# Altium schematic sheet Sheet_1_2025-02-26.schdoc
size 300 x 182 mm
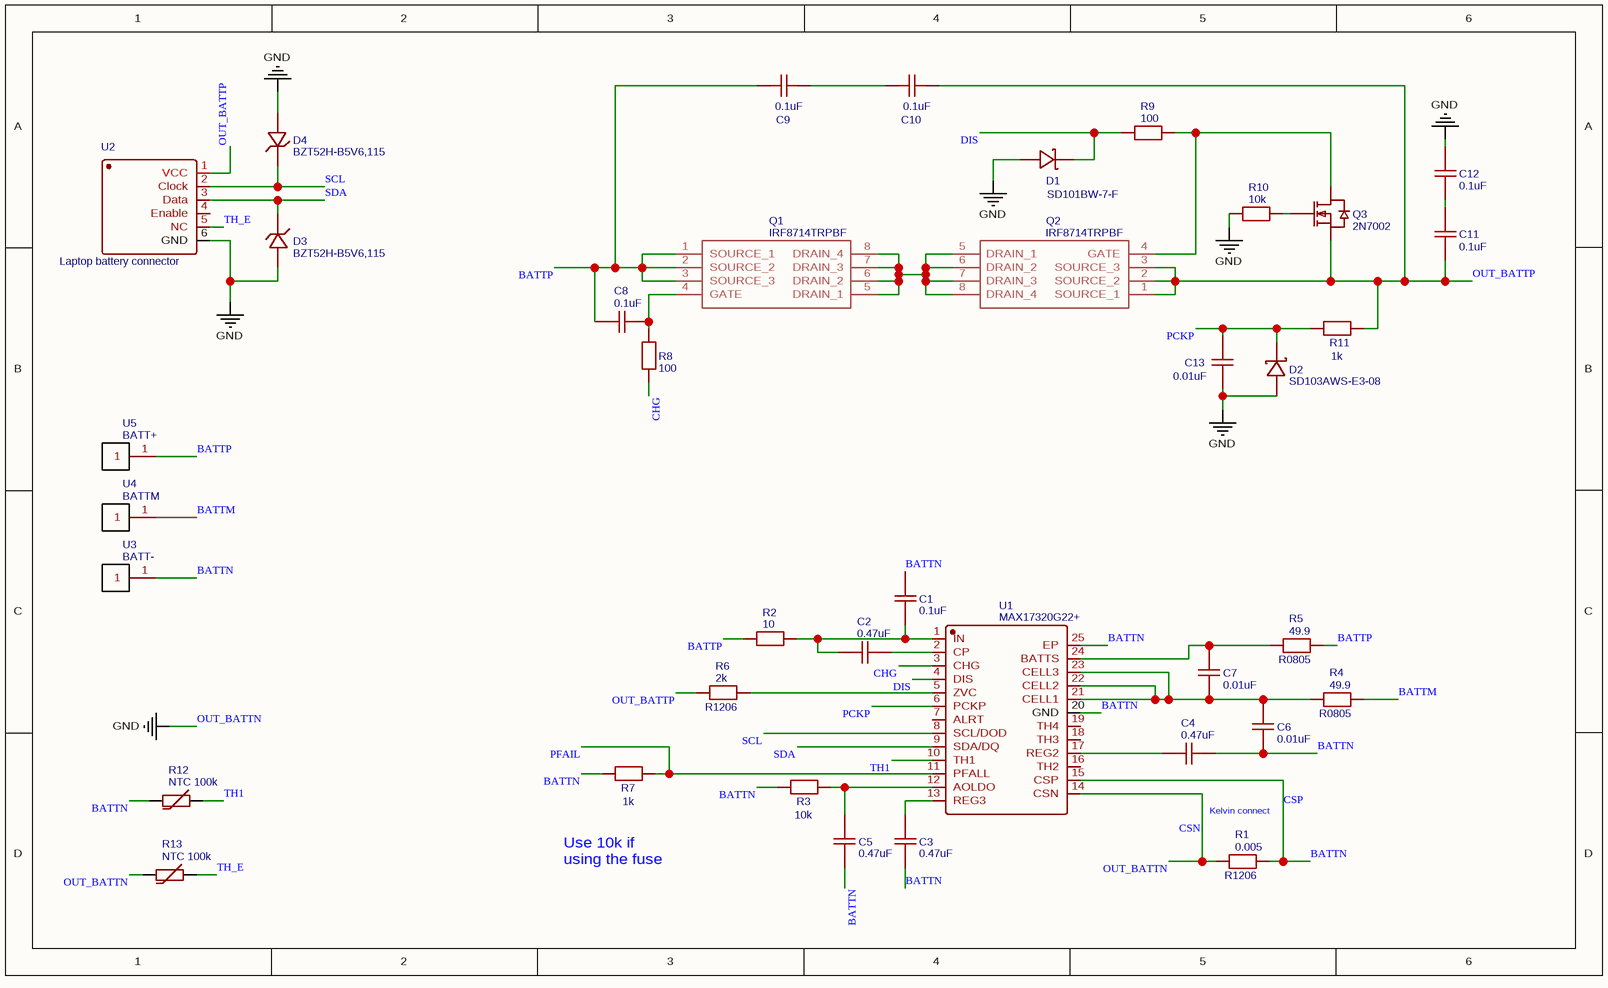
[diagram p0: Sheet_1_2025-02-26.schdoc]

## Parts
C1  0.1uF  [C0402]
C2  0.47uF  [C0402]
C3  0.47uF  [C0402]
C4  0.47uF  [C0402]
C5  0.47uF  [C0402]
C6  0.01uF  [C0402]
C7  0.01uF  [C0402]
C8  0.1uF  [C0402]
C9  0.1uF  [C0402]
C10  0.1uF  [C0402]
C11  0.1uF  [C0402]
C12  0.1uF  [C0402]
C13  0.01uF  [C0402]
D1  SD101BW-7-F  [SOD-323_L1.8-W1.3-LS2.5-RD]
D2  SD103AWS-E3-08  [SOD-323_L1.8-W1.3-LS2.5-RD]
D3  BZT52H-B5V6,115  [SOD-123F_L2.8-W1.8-LS3.7-RD]
D4  BZT52H-B5V6,115  [SOD-123F_L2.8-W1.8-LS3.7-RD]
Q1  IRF8714TRPBF  [SOIC127P600X175-8N]
Q2  IRF8714TRPBF  [SOIC127P600X175-8N]
Q3  2N7002  [SOT-23-3_L2.9-W1.3-P1.90-LS2.4-BR]
R1  0.005  [R1206]
R2  10  [R0402]
R3  10k  [R0402]
R4  49.9  [R0805]
R5  49.9  [R0805]
R6  2k  [R1206]
R7  1k  [R0402]
R8  100  [R0402]
R9  100  [R0402]
R10  10k  [R0402]
R11  1k  [R0402]
R12  NTC 100k  [R0805]
R13  NTC 100k  [R0805]
U1  MAX17320G22+  [QFN-24_L4.0-W4.0-P0.50-BL-EP2.6]
U2  Laptop battery connector  [6 PIN LAPTOP CONNECTOR]
U3  BATT-  [PAD-1X-5X5MM]
U4  BATTM  [PAD-1X-5X5MM]
U5  BATT+  [PAD-1X-5X5MM]

## Nets
CSN: C12.2 C13.2 D1.2(A) D2.2(A) D3.2(A) D4.2(A) R1.1 R10.1 R13.1 U1.14(CSN) U2.6(GND)  [also labelled GND, OUT_BATTN]
BATTM: R4.2 U4.1
BATTN: C1.2 C3.1 C4.1 C5.2 C6.1 R1.2 R3.1 R7.1 R12.1 U1.15(CSP) U1.20(GND) U1.25(EP) U3.1  [also labelled CSP]
BATTP: C8.2 C9.2 Q1.1(SOURCE_1) Q1.2(SOURCE_2) Q1.3(SOURCE_3) R2.1 R5.2 U5.1
CHG: R8.1 U1.3(CHG)
DIS: D1.1(C) R9.1 U1.4(DIS)
OUT_BATTP: C10.1 C11.1 Q2.1(SOURCE_1) Q2.2(SOURCE_2) Q2.3(SOURCE_3) Q3.2(S) R6.1 R11.2 U2.1(VCC)
PCKP: C13.1 D2.1(K) R11.1 U1.6(PCKP)
PFAIL: R7.2 U1.11(PFALL)
SCL: D4.1(C) U1.8(SCL/DOD) U2.2(Clock)
SDA: D3.1(C) U1.9(SDA/DQ) U2.3(Data)
TH1: R12.2 U1.10(TH1)
TH_E: R13.2 U2.5(NC)
NetC1_1: C1.1 C2.2 R2.2 U1.1(IN)
NetC2_1: C2.1 U1.2(CP)
NetC3_2: C3.2 U1.13(REG3)
NetC4_2: C4.2 U1.17(REG2)
NetC5_1: C5.1 R3.2 U1.12(AOLDO)
NetC6_2: C6.2 C7.2 R4.1 U1.21(CELL1) U1.22(CELL2) U1.23(CELL3)
NetC7_1: C7.1 R5.1 U1.24(BATTS)
NetC8_1: C8.1 Q1.4(GATE) R8.2
NetC9_1: C9.1 C10.2
NetC11_2: C11.2 C12.1
NetQ1_5: Q1.5(DRAIN_1) Q1.6(DRAIN_2) Q1.7(DRAIN_3) Q1.8(DRAIN_4) Q2.5(DRAIN_1) Q2.6(DRAIN_2) Q2.7(DRAIN_3) Q2.8(DRAIN_4)
NetQ2_4: Q2.4(GATE) Q3.3(D) R9.2
NetQ3_1: Q3.1(G) R10.2
NetR6_2: R6.2 U1.5(ZVC)

Not connected (* = marked no-connect by the designer): U1 7(ALRT) 16(TH2) 18(TH3) 19(TH4); U2 4(Enable)

## Notes on the sheet
- Use 10k if
  using the fuse
- Kelvin connect
- (in symbol 0.005) R1206
- (in symbol 2k) R1206
- (in symbol 49.9) R0805

## Library data of the parts
C1 C8-C12 = 0.1uF: nameAlias: Value(F); Contributor: LCEDA_Lib; Note: 25V; spicePre: C; spiceSymbolName: C_0603_US
C2 = 0.47uF: nameAlias: Value(F); Contributor: LCEDA_Lib; Package Display: No; Note: 25V; spicePre: C; spiceSymbolName: C_0603_US
C3-C5 = 0.47uF: nameAlias: Value(F); Contributor: LCEDA_Lib; Note: 10V; spicePre: C; spiceSymbolName: C_0603_US
C6 C7 = 0.01uF: nameAlias: Value(F); Contributor: LCEDA_Lib; Note: 10V; spicePre: C; spiceSymbolName: C_0603_US
C13 = 0.01uF: nameAlias: Value(F); Contributor: LCEDA_Lib; Note: 50V; spicePre: C; spiceSymbolName: C_0603_US
D1 = SD101BW-7-F: Manufacturer: Diodes Incorporated; Manufacturer Part: SD101BWS-7-F; Contributor: LCSC; Supplier: LCSC; Supplier Part: C526757; JLCPCB Part Class: Extended Part; spicePre: D; spiceSymbolName: SD101BWS-7-F
D2 = SD103AWS-E3-08: Manufacturer: VISHAY; Contributor: LCSC; Supplier: LCSC; Manufacturer Part: SD103AWS-E3-08; Supplier Part: C142592; JLCPCB Part Class: Extended Part; spicePre: D; spiceSymbolName: SD103AWS-E3-08
D3 D4 = BZT52H-B5V6,115: Manufacturer: Nexperia; Contributor: LCSC; Supplier: LCSC; Supplier Part: C426804; Manufacturer Part: BZT52H-B5V6,115; JLCPCB Part Class: Extended Part; spicePre: D; spiceSymbolName: BZT52H-B5V6,115
Q1 Q2 = IRF8714TRPBF: Contributor: Jorge Ignacio Sánchez Flores; spicePre: Q; spiceSymbolName: IRF8714TRPBF
Q3 = 2N7002: Manufacturer: CJ; Supplier: LCSC; Manufacturer Part: 2N7002; Supplier Part: C8545; JLCPCB Part Class: Basic Part; spicePre: Q; spiceSymbolName: 2N7002
R1 = 0.005: nameAlias: Value(Ω); Contributor: LCEDA_Lib; Package Display: Yes; spicePre: R; spiceSymbolName: R_1206_EU
R2 = 10: nameAlias: Value(Ω); Contributor: LCEDA_Lib; Package Display: No; spicePre: R; spiceSymbolName: R_0603_EU
R3 R10 = 10k: nameAlias: Value(Ω); Contributor: LCEDA_Lib; spicePre: R; spiceSymbolName: R_0603_EU
R4 = 49.9: nameAlias: Value(Ω); Contributor: LCEDA_Lib; Package Display: Yes; spicePre: R; spiceSymbolName: R_0805_EU
R5 = 49.9: Manufacturer Part: RMC080549.91%N; Manufacturer: Tyohm; nameAlias: Value(Ω); Contributor: LCEDA_Lib; Package Display: Yes; Supplier Part: C269747; Supplier: LCSC; spicePre: R; spiceSymbolName: R_0805_EU
R6 = 2k: nameAlias: Value(Ω); Contributor: LCEDA_Lib; Package Display: Yes; Note: 0.25W; spicePre: R; spiceSymbolName: R_1210_EU
R7 = 1k: nameAlias: Value(Ω); Contributor: LCEDA_Lib; Package Display: No; spicePre: R; spiceSymbolName: R_0603_EU
R8 R9 = 100: nameAlias: Value(Ω); Contributor: LCEDA_Lib; spicePre: R; spiceSymbolName: R_0603_EU
R11 = 1k: nameAlias: Value(Ω); Contributor: LCEDA_Lib; spicePre: R; spiceSymbolName: R_0603_EU
R12 R13 = NTC 100k: Manufacturer: FH; Manufacturer Part: CMFB102J3200HANT; nameAlias: Value; Supplier: LCSC; Supplier Part: C75245; JLCPCB Part Class: Extended Part; spicePre: R; spiceSymbolName: CMFB102J3200HANT
U1 = MAX17320G22+: Contributor: LCSC; Supplier: LCSC; Supplier Part: C2914309; Manufacturer Part: MAX17320G22+; JLCPCB Part Class: Extended Part; spicePre: U; spiceSymbolName: MAX17320G22+
U2 = Laptop battery connector: Contributor: PixelCircuit; spicePre: U; spiceSymbolName: Laptop battery connector
U3 = BATT-: Contributor: luisf18; spicePre: U; spiceSymbolName: PAD1
U4 = BATTM: Contributor: luisf18; spicePre: U; spiceSymbolName: PAD1
U5 = BATT+: Contributor: luisf18; spicePre: U; spiceSymbolName: PAD1